# Altium project fyFly.PrjPcb
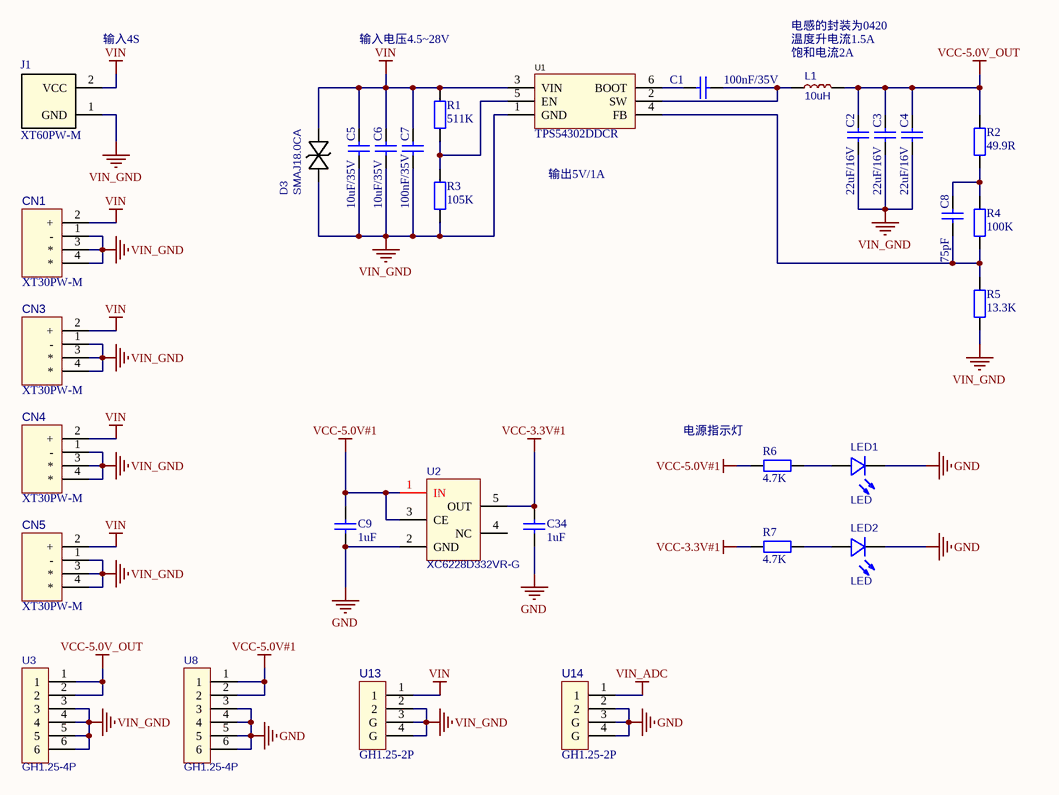
[diagram p0: 00_power.SchDoc]
4 sheets, 121 parts. Net scope: global (net labels, ports and power ports of the same name join across sheets).
Board files: fyFly.PcbDoc, fyFly _cp1.PcbDoc, fyFly_cp2.PcbDoc
Sheets:
  00_power.SchDoc
  01_mcu.SchDoc
  02_sensor.SchDoc
  03_peripheral.SchDoc

## Sheet 00_power.SchDoc
size A4; SheetNumber: 1; SheetTotal: 4

### Parts
C1  100nF/35V  [0603-C]
C2  22uF/16V  [1206-C]
C3  22uF/16V  [1206-C]
C4  22uF/16V  [1206-C]
C5  10uF/35V  [0805-C]
C6  10uF/35V  [0805-C]
C7  100nF/35V  [0805-C]
C8  75pF  [0603-C]
C9  1uF  [0603-C]
C34  1uF  [0603-C]
CN1  XT30PW-M  [XT30PW-M]
CN3  XT30PW-M  [XT30PW-M]
CN4  XT30PW-M  [XT30PW-M]
CN5  XT30PW-M  [XT30PW-M]
D3  SMAJ18.0CA  [ZENER]
J1  XT60PW-M  [XT60PW-M]
L1  10uH  [电感 4.2X4.4]
LED1  LED  [LED-0603]
LED2  LED  [LED-0603]
R1  511K  [0603-R]
R2  49.9R  [0603-R]
R3  105K  [0603-R]
R4  100K  [0603-R]
R5  13.3K  [0603-R]
R6  4.7K  [0603-R]
R7  4.7K  [0603-R]
U1  TPS54302DDCR  [TPS54302]
U2  XC6228D332VR-G  [XC6228D332VR-G]
U3  GH1.25-4P  [CONN-SMD_GH1.25-4PWBPZ]
U8  GH1.25-4P  [CONN-SMD_GH1.25-4PWBPZ]
U13  GH1.25-2P  [GH1.25-2P]
U14  GH1.25-2P  [GH1.25-2P]

### Nets
GND: C9.1 C34.1 LED1.1(-) LED2.1(-) U2.2(GND) U8.3 U8.4 U8.5 U8.6 U14.2 U14.3(G) U14.4(G)
VCC-3.3V#1: C34.2 R7.1 U2.5(OUT)
VCC-5.0V#1: C9.2 R6.1 U2.1(IN) U2.3(CE) U8.1 U8.2
VCC-5.0V_OUT: C2.2 C3.2 C4.2 L1.2 R2.2 U3.1 U3.2
VIN: C5.2 C6.2 C7.2 CN1.2(+) CN3.2(+) CN4.2(+) CN5.2(+) D3.2(A) J1.2(VCC) R1.2 U1.3(VIN) U13.1
VIN_ADC: U14.1
VIN_GND: C2.1 C3.1 C4.1 C5.1 C6.1 C7.1 CN1.1(-) CN1.3 CN1.4 CN3.1(-) CN3.3 CN3.4 CN4.1(-) CN4.3 CN4.4 CN5.1(-) CN5.3 CN5.4 D3.1(C) J1.1(GND) R3.1 R5.1 U1.1(GND) U3.3 U3.4 U3.5 U3.6 U13.2 U13.3(G) U13.4(G)
NetC1_1: C1.1 U1.6(BOOT)
NetC1_2: C1.2 L1.1 U1.2(SW)
NetC8_1: C8.1 R4.1 R5.2 U1.4(FB)
NetC8_2: C8.2 R2.1 R4.2
NetLED1_2: LED1.2(+) R6.2
NetLED2_2: LED2.2(+) R7.2
NetR1_1: R1.1 R3.2 U1.5(EN)

Not connected (* = marked no-connect by the designer): U2 4(NC)

### Notes on the sheet
- (near J1) 输入4S
- 输入电压4.5~28V
- 电感的封装为0420
- (near L1) 温度升电流1.5A
- (near L1) 饱和电流2A
- 输出5V/1A
- 电源指示灯

### Library data of the parts
C1-C9 C34 = C: 贴片电容; BOM名称: 无极性贴片电容; 联系卖家，免费查找封装: 唯一出售店铺网址https://shop463601444.taobao.com
CN1 CN3-CN5 = XT30PW-M: Manufacturer: AMASS(艾迈斯); Add into BOM: yes; Brand: 艾迈斯; RatedVoltage: DC 500V; InterfaceType: 公头; RatedCurrent: 15A; RecommendedWireGauge: 16/18/20AWG; contact resistance: 1.2mΩ; specifications: 2pin; Symbol: XT30PW-M; Device: XT30PW-M; Supplier: LCSC; Supplier Part: C431092; Manufacturer Part: XT30PW-M; JLCPCB Part Class: Extended Part; LCSC Part Name: AMASS(艾迈斯)航模插头 卧式弯脚 XT30PW-M公头; Supplier Footprint: -; Datasheet: https://atta.szlcsc.com/upload/public/pdf/source/20220222/6A9F22F7850E25B33E1BE430ADF8560B.pdf; Convert to PCB: yes; Model: XT30PW-M; Power: -; Output: -; Input: -; Size: -; Interface: -; Type: 航模插头; Colour: -; MaximumCurrent: -; Type1: -; NumberOfUSBHoles: -; MetalMaterial: -; InsulationMaterial: -; FlameRetardantGrade: -; Belt length: -
D3 = SMAJ6.0CA: SMAJ6.0CA_C698928; BOM_Manufacturer: Yangzhou Yangjie Elec Tech; Contributor: LCSC; BOM_Supplier: LCSC; BOM_Supplier Part: C698928; BOM_Manufacturer Part: SMAJ6.0CA; BOM_JLCPCB Part Class: Extended Part; spicePre: D; spiceSymbolName: SMAJ6.0CA_C698928
J1 = XT60PW-M: PCB Power Connector; Manufacturer_Name: Amass; Manufacturer_Part_Number: XT60PW-F; Datasheet Link: https://www.tme.eu/sl/Document/ce4077e36b79046da520ca73227e15de/XT30PW%20SPEC.pdf; Height: 8.4mm
L1 = L: BOM_Manufacturer: Sunlord; BOM_Manufacturer Part: UPZ2012D800-4R0TF; nameAlias: Value; Contributor: LCSC; BOM_Supplier: LCSC; BOM_Supplier Part: C145060; BOM_JLCPCB Part Class: Extended Part; spicePre: L; spiceSymbolName: UPZ2012D800-4R0TF
LED1 LED2 = LED: BOM_Manufacturer: Wuxi ARK Tech Elec; BOM_Manufacturer Part: D-G060306G1-KS2; Contributor: LCSC; BOM_Supplier: LCSC; BOM_Supplier Part: C118334; BOM_JLCPCB Part Class: Extended Part; spicePre: L; spiceSymbolName: D-G060306G1-KS2
R1-R7 = R: 贴片电阻; 联系卖家，免费查找封装: 唯一出售店铺网址https://shop463601444.taobao.com; BOM名称: 贴片电阻
U1 = TPS54302DDCR: Manufacturer: TI(德州仪器); Symbol: TPS54302DDCR_C311983; Add into BOM: yes; Function: 降压型; Synchronous Rectification: 是; Output Type: 可调; Number of Outputs: 1; Topology: 降压式; Input Voltage: 4.5V~28V; Output Voltage: 596mV~28V; Output Current (Max): 3A; Switching Frequency: 400kHz; Device: TPS54302DDCR; LCSC Part Name: 降压型 输入4.5V~28V 输出596mV~28V 3A; Supplier Part: C311983; Manufacturer Part: TPS54302DDCR; Supplier Footprint: TSOT-23-6; JLCPCB Part Class: Extended Part; Datasheet: https://atta.szlcsc.com/upload/public/pdf/source/20181023/C311983_0948EE70BFAD2011B492BD3F4CEA709D.pdf; Supplier: LCSC; Convert to PCB: yes; Operating Temperature: -40℃~+125℃@(TJ)
U2 = XC6228D332VR-G: 输出类型：固定 输出极性：正 输出通道数：1 最大输入电压：5.5V 输出电压：3.3V 压差：305mV@(300mA) 输出电流：300mA 电源纹波抑制比(PSRR)：80dB@(1kHz) 3.3V固定输出，Iout=300mA，Vin=5.5V(Max); BOM_Manufacturer: TOREX; BOM_Supplier: LCSC; BOM_Manufacturer Part: XC6228D332VR-G; BOM_Supplier Part: C69841; BOM_JLCPCB Part Class: Extended Part; spicePre: U; spiceSymbolName: XC6228D332VR-G
U3 U8 = GH1.25-4P: GH1.25-4PWBPZ; BOM_Manufacturer: BOOMELE(博穆精密); Contributor: LCSC; BOM_Supplier: LCSC; BOM_Supplier Part: C2829253; BOM_Manufacturer Part: GH1.25-4PWBPZ; spicePre: U; spiceSymbolName: GH1.25-4PWBPZ
U13 U14 = GH1.25-2P: Manufacturer: Bossie(博锡); Symbol: BX-GH1.25-2PWT; Add into BOM: yes; Pins Structure: 1x2P; Pitch: 1.25mm; Reference Series: GH; Number of PINs Per Row: 2; Current Rating (Max): 1A; Device: BX-GH1.25-2PWT; Supplier: LCSC; Supplier Part: C18077718; Manufacturer Part: BX-GH1.25-2PWT; LCSC Part Name: BX-GH1.25-2PWT; Supplier Footprint: SMD,P=1.25mm,卧贴; Datasheet: https://atta.szlcsc.com/upload/public/pdf/source/20231017/25DD0A5C9398B9B8D9D2789B9E1BDAD3.pdf; Convert to PCB: yes; Mounting Style: 卧贴; Number of Pins: 2P; Number of Rows: 1; Row Spacing: -; Contact Material: 磷铜; Contact Plating: 锡; Operating Temperature Range: -25℃~+85℃

## Sheet 01_mcu.SchDoc
size A4; SheetNumber: 2; SheetTotal: 4
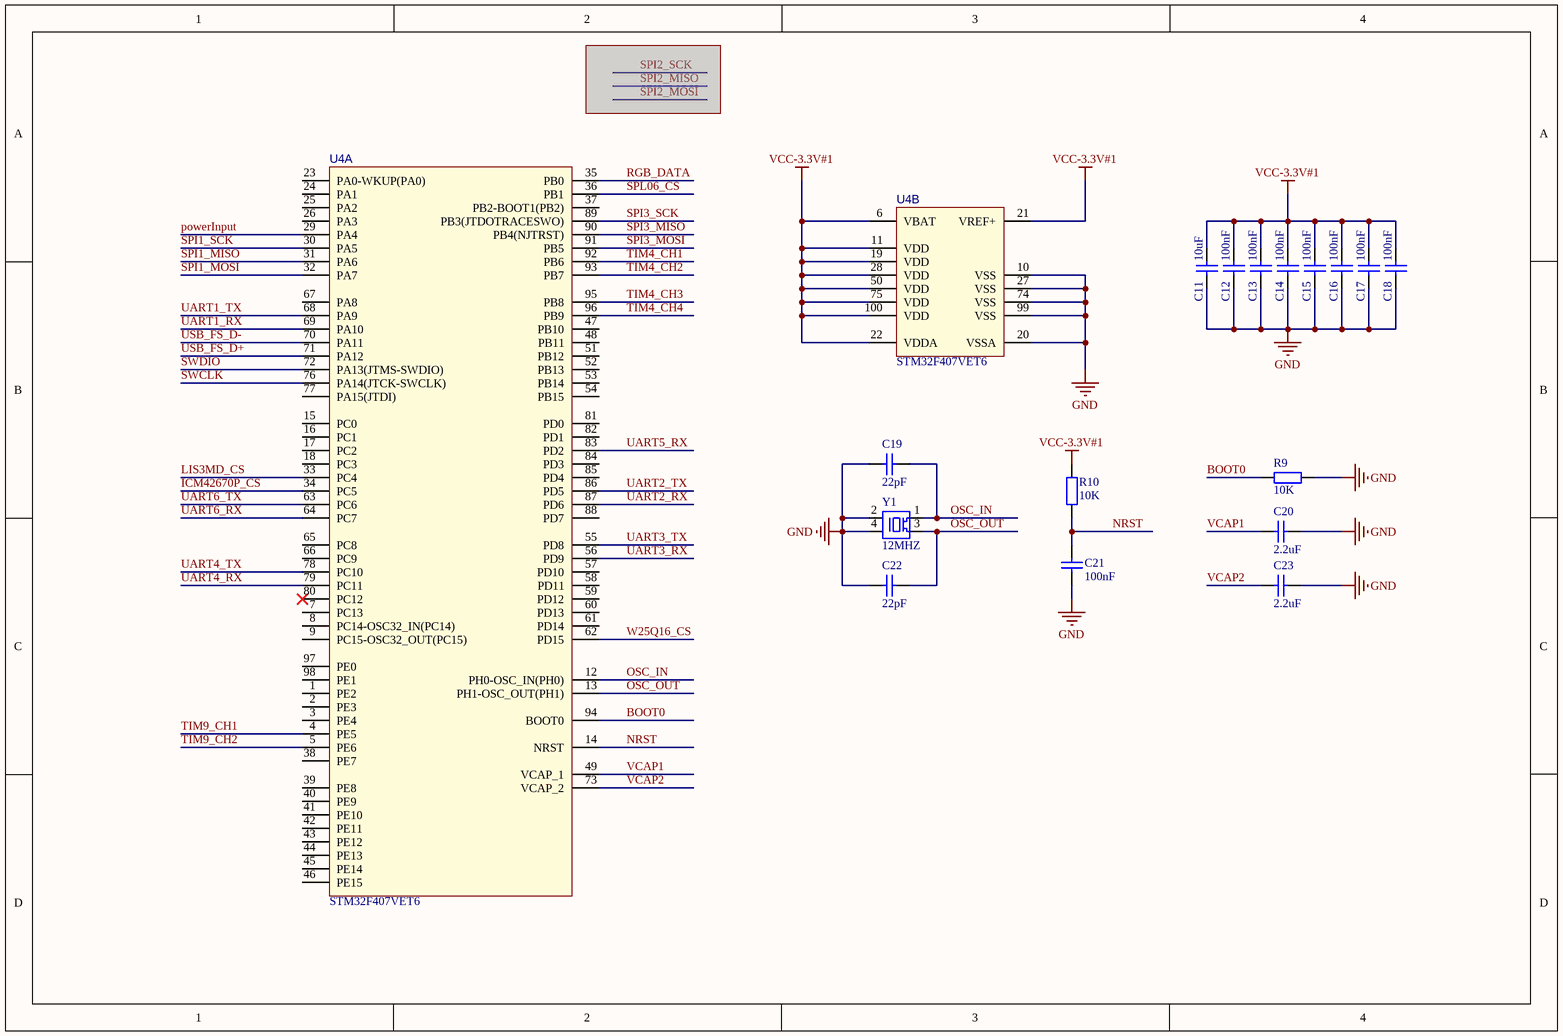
[diagram p1: 01_mcu.SchDoc]

### Parts
C11  10uF  [0603-C]
C12  100nF  [0603-C]
C13  100nF  [0603-C]
C14  100nF  [0603-C]
C15  100nF  [0603-C]
C16  100nF  [0603-C]
C17  100nF  [0603-C]
C18  100nF  [0603-C]
C19  22pF  [0603-C]
C20  2.2uF  [0603-C]
C21  100nF  [0603-C]
C22  22pF  [0603-C]
C23  2.2uF  [0603-C]
R9  10K  [0603-R]
R10  10K  [0603-R]
U4  STM32F407VET6  [STM32F407VET6]  (parts A,B of 2)
Y1  12MHZ  [3225]

### Nets
GND: C11.1 C12.1 C13.1 C14.1 C15.1 C16.1 C17.1 C18.1 C19.1 C20.2 C21.1 C22.1 C23.2 R9.1 U4.10(VSS) U4.20(VSSA) U4.27(VSS) U4.74(VSS) U4.99(VSS) Y1.2(GND) Y1.4(GND)
VCC-3.3V#1: C11.2 C12.2 C13.2 C14.2 C15.2 C16.2 C17.2 C18.2 R10.2 U4.6(VBAT) U4.11(VDD) U4.19(VDD) U4.21(VREF+) U4.22(VDDA) U4.28(VDD) U4.50(VDD) U4.75(VDD) U4.100(VDD)
BOOT0: R9.2 U4.94(BOOT0)
ICM42670P_CS: U4.34(PC5)
LIS3MD_CS: U4.33(PC4)
NRST: C21.2 R10.1 U4.14(NRST)
OSC_IN: C19.2 U4.12(PH0-OSC_IN(PH0)) Y1.1(XTAL1)
OSC_OUT: C22.2 U4.13(PH1-OSC_OUT(PH1)) Y1.3(XTAL3)
powerInput: U4.29(PA4)
RGB_DATA: U4.35(PB0)
SPI1_MISO: U4.31(PA6)
SPI1_MOSI: U4.32(PA7)
SPI1_SCK: U4.30(PA5)
SPI3_MISO: U4.90(PB4(NJTRST))
SPI3_MOSI: U4.91(PB5)
SPI3_SCK: U4.89(PB3(JTDOTRACESWO))
SPL06_CS: U4.36(PB1)
SWCLK: U4.76(PA14(JTCK-SWCLK))
SWDIO: U4.72(PA13(JTMS-SWDIO))
TIM4_CH1: U4.92(PB6)
TIM4_CH2: U4.93(PB7)
TIM4_CH3: U4.95(PB8)
TIM4_CH4: U4.96(PB9)
TIM9_CH1: U4.4(PE5)
TIM9_CH2: U4.5(PE6)
UART1_RX: U4.69(PA10)
UART1_TX: U4.68(PA9)
UART2_RX: U4.87(PD6)
UART2_TX: U4.86(PD5)
UART3_RX: U4.56(PD9)
UART3_TX: U4.55(PD8)
UART4_RX: U4.79(PC11)
UART4_TX: U4.78(PC10)
UART5_RX: U4.83(PD2)
UART6_RX: U4.64(PC7)
UART6_TX: U4.63(PC6)
USB_FS_D+: U4.71(PA12)
USB_FS_D-: U4.70(PA11)
VCAP1: C20.1 U4.49(VCAP_1)
VCAP2: C23.1 U4.73(VCAP_2)
W25Q16_CS: U4.62(PD15)

Not connected (* = marked no-connect by the designer): U4 1(PE2) 2(PE3) 3(PE4) 7(PC13) 8(PC14-OSC32_IN(PC14)) 9(PC15-OSC32_OUT(PC15)) 15(PC0) 16(PC1) 17(PC2) 18(PC3) 23(PA0-WKUP(PA0)) 24(PA1) 25(PA2) 26(PA3) 37(PB2-BOOT1(PB2)) 38(PE7) 39(PE8) 40(PE9) 41(PE10) 42(PE11) 43(PE12) 44(PE13) 45(PE14) 46(PE15) 47(PB10) 48(PB11) 51(PB12) 52(PB13) 53(PB14) 54(PB15) 57(PD10) 58(PD11) 59(PD12) 60(PD13) 61(PD14) 65(PC8) 66(PC9) 67(PA8) 77(PA15(JTDI)) 80(PC12)* 81(PD0) 82(PD1) 84(PD3) 85(PD4) 88(PD7) 97(PE0) 98(PE1)

### Library data of the parts
C11-C23 = C: as C1 on sheet 00_power
R9 R10 = R: as R1 on sheet 00_power; BOM名称: 贴片电阻
U4 = STM32F407VET6: Manufacturer: ST(意法半导体); Add into BOM: yes; CPU Core: ARM Cortex-M4; CPU Maximum Speed: 168MHz; Operating Voltage Range: 1.8V~3.6V; Program Storage Size: 512KB; Program Memory Type: FLASH; RAM Size: 192KB; GPIO Ports Number: 82; ADC (Bit): 12bit; Universal Serial Bus: 有; Peripheral/Function: DMA；LCD/LED驱动；PWM; tags: STM32; Name: STM32F407VET6; Symbol: STM32F407VET6; Device: STM32F407VET6; LCSC Part Name: STM32F407VET6; Supplier Part: C28730; Manufacturer Part: STM32F407VET6; Supplier Footprint: LQFP-100(14x14); JLCPCB Part Class: Extended Part; Datasheet: https://atta.szlcsc.com/upload/public/pdf/source/20140801/1457707197138.pdf; Supplier: LCSC; Convert to PCB: yes; EEPROM: -; DAC (Bit): 12bit; PWM (Bit): -; Internal Comparator: -; communication protocol: -; Watchdog: 有; Real-Time Clock: -; Infrared Data Association: 有; Low-Voltage Detect: 有; CCP Capture/Compare: -; LCD Module: 有; Secure Digital Input and Output: -; Direct Memory Access: 有; Internal Oscillator: 有; Operating Temperature Range: -40℃~+85℃; image: http://image.lceda.cn/szlcsc/C28730.jpg
Y1 = Y: 无源晶振

## Sheet 02_sensor.SchDoc
size A3; SheetNumber: 3; SheetTotal: 4
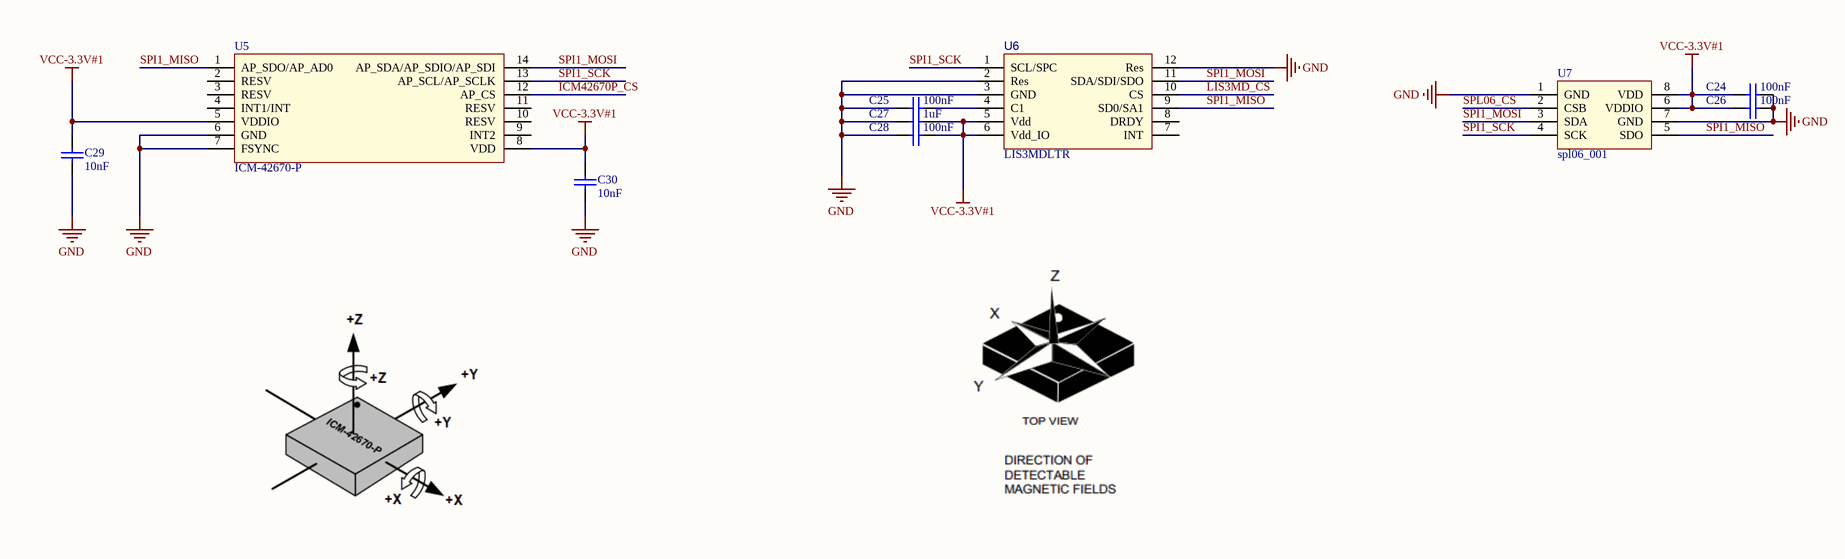
[diagram p2: 02_sensor.SchDoc]

### Parts
C24  100nF  [0603-C]
C25  100nF  [0603-C]
C26  100nF  [0603-C]
C27  1uF  [0603-C]
C28  100nF  [0603-C]
C29  10nF  [0603-C]
C30  10nF  [0603-C]
U5  ICM-42670-P  [ICM42670P]
U6  LIS3MDLTR  [LIS3MDLTR]
U7  spl06_001  [SPL06]

### Nets
GND: C24.2 C25.1 C26.2 C27.1 C28.1 C29.1 C30.1 U5.6(GND) U5.7(FSYNC) U6.2(Res) U6.3(GND) U6.12(Res) U7.1(GND) U7.7(GND)
VCC-3.3V#1: C24.1 C26.1 C27.2 C28.2 C29.2 C30.2 U5.5(VDDIO) U5.8(VDD) U6.5(Vdd) U6.6(Vdd_IO) U7.6(VDDIO) U7.8(VDD)
ICM42670P_CS: U5.12(AP_CS)
LIS3MD_CS: U6.10(CS)
SPI1_MISO: U5.1(AP_SDO/AP_AD0) U6.9(SD0/SA1) U7.5(SDO)
SPI1_MOSI: U5.14(AP_SDA/AP_SDIO/AP_SDI) U6.11(SDA/SDI/SDO) U7.3(SDA)
SPI1_SCK: U5.13(AP_SCL/AP_SCLK) U6.1(SCL/SPC) U7.4(SCK)
SPL06_CS: U7.2(CSB)
NetC25_2: C25.2 U6.4(C1)

Not connected (* = marked no-connect by the designer): U5 2(RESV) 3(RESV) 4(INT1/INT) 9(INT2) 10(RESV) 11(RESV); U6 7(INT) 8(DRDY)

### Library data of the parts
C24-C30 = C: as C1 on sheet 00_power
U5 = ICM-42670-P: Manufacturer: TDK InvenSense(应美盛); Add into BOM: yes; Sensor Type: 加速度计陀螺仪; Symbol: ICM-42670-P; Device: ICM-42670-P; Supplier: LCSC; Supplier Part: C3288646; Manufacturer Part: ICM-42670-P; JLCPCB Part Class: 扩展库; LCSC Part Name: ICM-42670-P; Supplier Footprint: LGA-14(2.5x3); Datasheet: /pdf/applyPasteComponent/2023-06-06/453894A/f777f4f41a0e4ea2b93b88a9675b1ac5/ICM-42670-P.pdf; Convert to PCB: yes; Operating Temperature: -40℃~+85℃; Name: ICM-42670-P
U6 = LIS3MDLTR: Manufacturer: ST(意法半导体); Add into BOM: yes; supply voltage: 1.9V~3.6V; Symbol: LIS3MDLTR; Device: LIS3MDLTR; Supplier: LCSC; Supplier Part: C478483; Manufacturer Part: LIS3MDLTR; JLCPCB Part Class: Extended Part; LCSC Part Name: 三轴数字磁传感器; Supplier Footprint: LGA-12(2x2); Datasheet: https://atta.szlcsc.com/upload/public/pdf/source/20191231/C478483_325C07DDDEF2D93C2E541FB70AD6AC5C.pdf; Convert to PCB: yes; Operating Temperature: -40℃~+85℃
U7 = SPL06_001: 气压计

## Sheet 03_peripheral.SchDoc
size A3; SheetNumber: 4; SheetTotal: 4
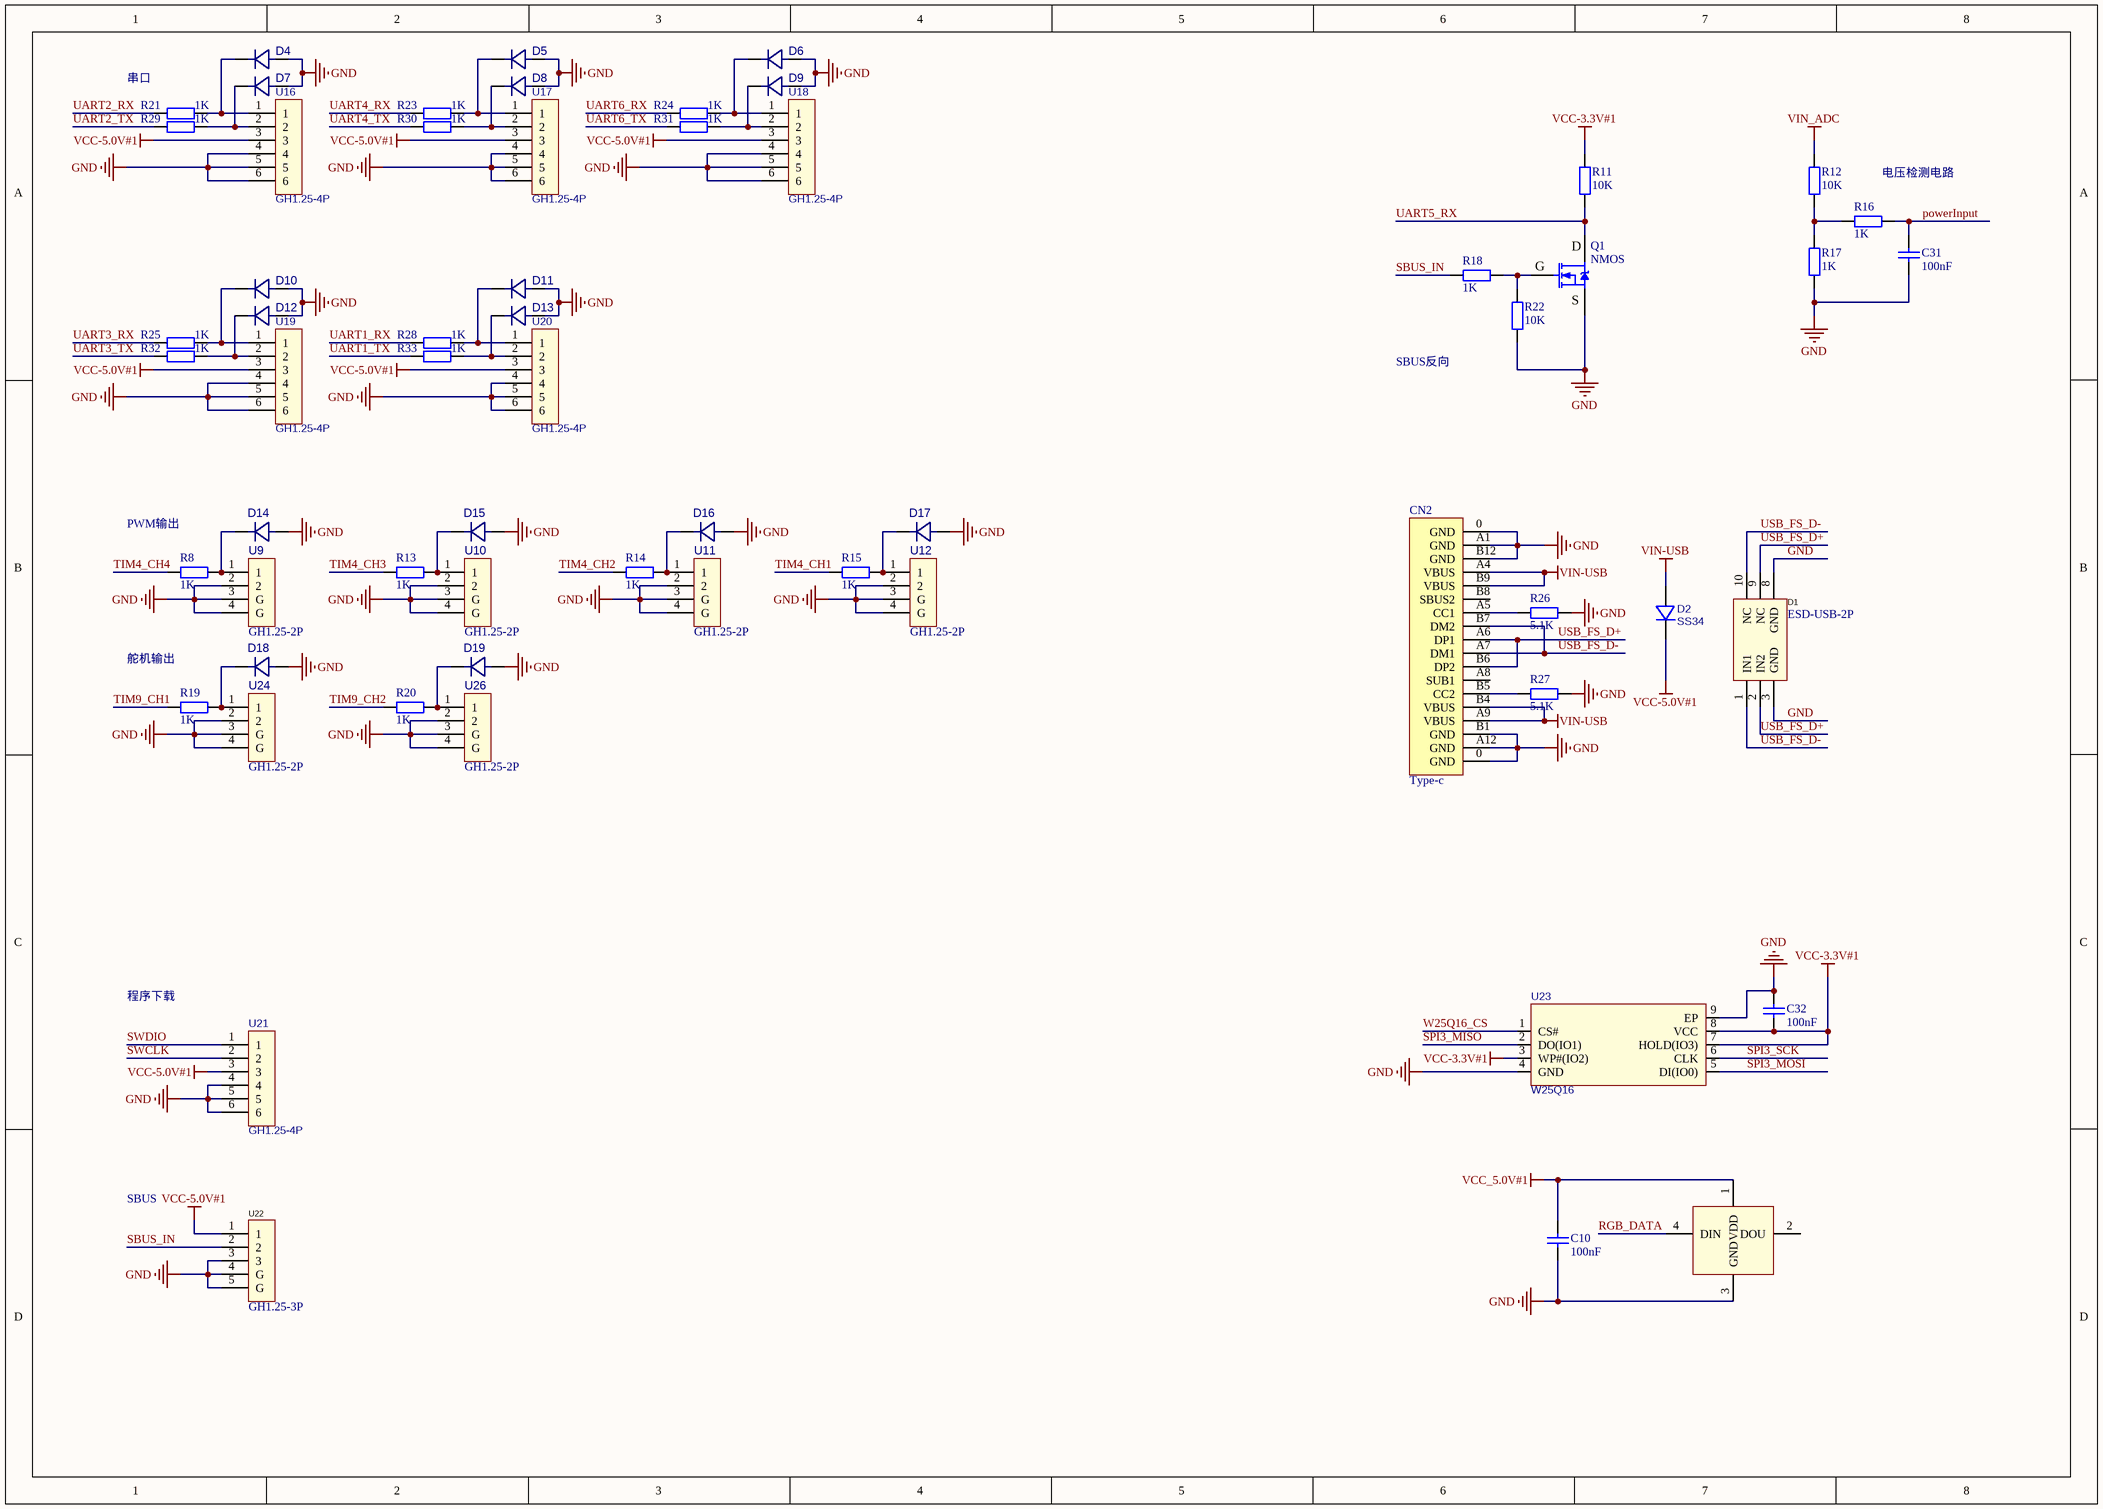
[diagram p3: 03_peripheral.SchDoc]

### Parts
C10  100nF  [0603-C]
C31  100nF  [0603-C]
C32  100nF  [0603-C]
CN2  Type-c  [Type-c 16pin]
D1  ESD-USB-2P  [SLP2510P8-2P]
D2  SS34  [SS34-SMA]
D4  ESD9X5.0ST5G  [ESD9X5.0ST5G]  (value not drawn)
D5  ESD9X5.0ST5G  [ESD9X5.0ST5G]  (value not drawn)
D6  ESD9X5.0ST5G  [ESD9X5.0ST5G]  (value not drawn)
D7  ESD9X5.0ST5G  [ESD9X5.0ST5G]  (value not drawn)
D8  ESD9X5.0ST5G  [ESD9X5.0ST5G]  (value not drawn)
D9  ESD9X5.0ST5G  [ESD9X5.0ST5G]  (value not drawn)
D10  ESD9X5.0ST5G  [ESD9X5.0ST5G]  (value not drawn)
D11  ESD9X5.0ST5G  [ESD9X5.0ST5G]  (value not drawn)
D12  ESD9X5.0ST5G  [ESD9X5.0ST5G]  (value not drawn)
D13  ESD9X5.0ST5G  [ESD9X5.0ST5G]  (value not drawn)
D14  ESD9X5.0ST5G  [ESD9X5.0ST5G]  (value not drawn)
D15  ESD9X5.0ST5G  [ESD9X5.0ST5G]  (value not drawn)
D16  ESD9X5.0ST5G  [ESD9X5.0ST5G]  (value not drawn)
D17  ESD9X5.0ST5G  [ESD9X5.0ST5G]  (value not drawn)
D18  ESD9X5.0ST5G  [ESD9X5.0ST5G]  (value not drawn)
D19  ESD9X5.0ST5G  [ESD9X5.0ST5G]  (value not drawn)
LED3  WS2812B-5050  [WS2812B-5050]  (value not drawn)
Q1  NMOS  [SOT23-3M]
R8  1K  [0603-R]
R11  10K  [0603-R]
R12  10K  [0603-R]
R13  1K  [0603-R]
R14  1K  [0603-R]
R15  1K  [0603-R]
R16  1K  [0603-R]
R17  1K  [0603-R]
R18  1K  [0603-R]
R19  1K  [0603-R]
R20  1K  [0603-R]
R21  1K  [0603-R]
R22  10K  [0603-R]
R23  1K  [0603-R]
R24  1K  [0603-R]
R25  1K  [0603-R]
R26  5.1K  [0603-R]
R27  5.1K  [0603-R]
R28  1K  [0603-R]
R29  1K  [0603-R]
R30  1K  [0603-R]
R31  1K  [0603-R]
R32  1K  [0603-R]
R33  1K  [0603-R]
U9  GH1.25-2P  [GH1.25-2P]
U10  GH1.25-2P  [GH1.25-2P]
U11  GH1.25-2P  [GH1.25-2P]
U12  GH1.25-2P  [GH1.25-2P]
U16  GH1.25-4P  [CONN-SMD_GH1.25-4PWBPZ]
U17  GH1.25-4P  [CONN-SMD_GH1.25-4PWBPZ]
U18  GH1.25-4P  [CONN-SMD_GH1.25-4PWBPZ]
U19  GH1.25-4P  [CONN-SMD_GH1.25-4PWBPZ]
U20  GH1.25-4P  [CONN-SMD_GH1.25-4PWBPZ]
U21  GH1.25-4P  [CONN-SMD_GH1.25-4PWBPZ]
U22  GH1.25-3P  [GH1.25-3P]
U23  W25Q16  [W25QXX_WSON_8_5*6mm]
U24  GH1.25-2P  [GH1.25-2P]
U26  GH1.25-2P  [GH1.25-2P]

### Nets
GND: C10.1 C31.1 C32.2 CN2.0(GND) CN2.A1(GND) CN2.A12(GND) CN2.B1(GND) CN2.B12(GND) D1.3(GND) D1.8(GND) D4.2(A) D5.2(A) D6.2(A) D7.2(A) D8.2(A) D9.2(A) D10.2(A) D11.2(A) D12.2(A) D13.2(A) D14.2(A) D15.2(A) D16.2(A) D17.2(A) D18.2(A) D19.2(A) LED3.3(GND) Q1.2(S) R17.1 R22.1 R26.2 R27.2 U9.2 U9.3(G) U9.4(G) U10.2 U10.3(G) U10.4(G) U11.2 U11.3(G) U11.4(G) U12.2 U12.3(G) U12.4(G) U16.4 U16.5 U16.6 U17.4 U17.5 U17.6 U18.4 U18.5 U18.6 U19.4 U19.5 U19.6 U20.4 U20.5 U20.6 U21.4 U21.5 U21.6 U22.3 U22.4(G) U22.5(G) U23.4(GND) U23.9(EP) U24.2 U24.3(G) U24.4(G) U26.2 U26.3(G) U26.4(G)
VCC-3.3V#1: C32.1 R11.2 U23.3(WP#(IO2)) U23.7(HOLD(IO3)) U23.8(VCC)
VCC-5.0V#1: D2.2(-) U16.3 U17.3 U18.3 U19.3 U20.3 U21.3 U22.1
VCC_5.0V#1: C10.2 LED3.1(VDD)
VIN-USB: CN2.A4(VBUS) CN2.A9(VBUS) CN2.B4(VBUS) CN2.B9(VBUS) D2.1(+)
VIN_ADC: R12.2
powerInput: C31.2 R16.2
RGB_DATA: LED3.4(DIN)
SBUS_IN: R18.1 U22.2
SPI3_MISO: U23.2(DO(IO1))
SPI3_MOSI: U23.5(DI(IO0))
SPI3_SCK: U23.6(CLK)
SWCLK: U21.2
SWDIO: U21.1
TIM4_CH1: R15.1
TIM4_CH2: R14.1
TIM4_CH3: R13.1
TIM4_CH4: R8.1
TIM9_CH1: R19.1
TIM9_CH2: R20.1
UART1_RX: R28.1
UART1_TX: R33.1
UART2_RX: R21.1
UART2_TX: R29.1
UART3_RX: R25.1
UART3_TX: R32.1
UART4_RX: R23.1
UART4_TX: R30.1
UART5_RX: Q1.3(D) R11.1
UART6_RX: R24.1
UART6_TX: R31.1
USB_FS_D+: CN2.A6(DP1) CN2.B6(DP2) D1.2(IN2) D1.9(NC)
USB_FS_D-: CN2.A7(DM1) CN2.B7(DM2) D1.1(IN1) D1.10(NC)
W25Q16_CS: U23.1(CS#)
NetCN2_A5: CN2.A5(CC1) R26.1
NetCN2_B5: CN2.B5(CC2) R27.1
NetD4_1: D4.1(K) R21.2 U16.1
NetD5_1: D5.1(K) R23.2 U17.1
NetD6_1: D6.1(K) R24.2 U18.1
NetD7_1: D7.1(K) R29.2 U16.2
NetD8_1: D8.1(K) R30.2 U17.2
NetD9_1: D9.1(K) R31.2 U18.2
NetD10_1: D10.1(K) R25.2 U19.1
NetD11_1: D11.1(K) R28.2 U20.1
NetD12_1: D12.1(K) R32.2 U19.2
NetD13_1: D13.1(K) R33.2 U20.2
NetD14_1: D14.1(K) R8.2 U9.1
NetD15_1: D15.1(K) R13.2 U10.1
NetD16_1: D16.1(K) R14.2 U11.1
NetD17_1: D17.1(K) R15.2 U12.1
NetD18_1: D18.1(K) R19.2 U24.1
NetD19_1: D19.1(K) R20.2 U26.1
NetQ1_1: Q1.1(G) R18.2 R22.2
NetR12_1: R12.1 R16.1 R17.2

Not connected (* = marked no-connect by the designer): CN2 A8(SUB1) B8(SBUS2); LED3 2(DOU)

### Notes on the sheet
- 串口
- (near R16) 电压检测电路
- SBUS反向
- (near R8) PWM输出
- (near R19) 舵机输出
- 程序下载
- SBUS

### Library data of the parts
C10 C31 C32 = C: as C1 on sheet 00_power
CN2 = Type-c: U262-161N-4BVC11
D1 = ESD-USB-2P: RClamp0522PATCT; Manufacturer: SEMTECH; Name: RClamp0524PATCT; Device: RClamp0524PATCT_C40960; Add into BOM: yes; Reverse Stand-Off Voltage (Vrwm): 5V; Breakdown Voltage (VBR): 6V; Clamping Voltage@Ipp: 15V; Peak Pulse Power(Ppp)@8/20us: 150W; Junction Capacitance(Cj)@1MHz: 0.8pF@1MHz; Symbol: RClamp0524PATCT; LCSC Part Name: RClamp0524PATCT; Supplier Part: C40960; Manufacturer Part: RClamp0524PATCT; Supplier Footprint: SLP2510P8; JLCPCB Part Class: Extended Part; Datasheet: https://atta.szlcsc.com/upload/public/pdf/source/20150124/1457707260739.pdf; Supplier: LCSC; Convert to PCB: yes; Operating Temperature: -55℃~+125℃@(Tj)
D2 = SS34: BOM_Manufacturer: Wuxi ARK Tech Elec; BOM_Manufacturer Part: D-G060306G1-KS2; Contributor: LCSC; BOM_Supplier: LCSC; BOM_Supplier Part: C118334; BOM_JLCPCB Part Class: Extended Part; spicePre: L; spiceSymbolName: D-G060306G1-KS2
D4-D19 = ESD9X5.0ST5G: Manufacturer: MSKSEMI(美森科); Symbol: ESD9X5.0ST5G_C3008066; Add into BOM: yes; Name: ESD9X5.0ST5G; Device: ESD9X5.0ST5G_C3008066; LCSC Part Name: ESD9X5.0ST5G; Supplier Part: C3008066; Manufacturer Part: ESD9X5.0ST5G; Supplier Footprint: SOD-923; JLCPCB Part Class: Extended Part; Datasheet: https://atta.szlcsc.com/upload/public/pdf/source/20220429/68E9B40153609821FAF30C4C48AA4713.pdf; Supplier: LCSC; Convert to PCB: yes
LED3 = WS2812B-5050: Manufacturer: XINGLIGHT(成兴光); Name: XL-5050RGBC-WS2812B; Add into BOM: yes; Emitted Color: RGB三色; Lens Color: 无色透明; Peak Wavelength: 625nm；470nm；530nm; Viewing Angle: 120°; Mounting Sytle: 正贴; Symbol: XL-5050RGBC-WS2812B; Device: XL-5050RGBC-WS2812B; LCSC Part Name: RGB三色 正贴 幻彩; Supplier Part: C2843785; Manufacturer Part: XL-5050RGBC-WS2812B; Supplier Footprint: SMD5050; JLCPCB Part Class: Extended Part; Datasheet: https://atta.szlcsc.com/upload/public/pdf/source/20230111/86AAD2096485A2E5BCAB883FF8CBE6FD.pdf; Supplier: LCSC; Convert to PCB: yes; Diode Configuration: -; Dominant Wavelength: -; Color Temperature: -; Forward Current: -; Power Dissipation: -; Operating Temperature: -30℃~+70℃
Q1 = AO3400: N沟道 30V/4.2A; BOM名称: 场效应管; 联系卖家，免费查找封装: 唯一出售店铺网址https://shop463601444.taobao.com; 参数: N沟道 30V/4.2A
R8 R11-R33 = R: as R1 on sheet 00_power; BOM名称: 贴片电阻
U9-U12 U24 U26 = GH1.25-2P: as U13 on sheet 00_power; Device: BX-GH1.25-2PWT; Supplier: LCSC; Supplier Part: C18077718; Manufacturer Part: BX-GH1.25-2PWT; LCSC Part Name: BX-GH1.25-2PWT; Supplier Footprint: SMD,P=1.25mm,卧贴; Datasheet: https://atta.szlcsc.com/upload/public/pdf/source/20231017/25DD0A5C9398B9B8D9D2789B9E1BDAD3.pdf; Convert to PCB: yes; Mounting Style: 卧贴; Number of Pins: 2P; Number of Rows: 1; Row Spacing: -; Contact Material: 磷铜; Contact Plating: 锡; Operating Temperature Range: -25℃~+85℃
U16-U21 = GH1.25-4P: as U3 on sheet 00_power; BOM_Supplier: LCSC; BOM_Supplier Part: C2829253; BOM_Manufacturer Part: GH1.25-4PWBPZ; spicePre: U; spiceSymbolName: GH1.25-4PWBPZ
U22 = GH1.25-3P: Manufacturer: Bossie(博锡); Symbol: BX-GH1.25-3PWT; Add into BOM: yes; Pins Structure: 1x3P; Pitch: 1.25mm; Reference Series: GH; Number of PINs Per Row: 3; Current Rating (Max): 1A; Device: BX-GH1.25-3PWT; Supplier: LCSC; Supplier Part: C18077719; Manufacturer Part: BX-GH1.25-3PWT; LCSC Part Name: BX-GH1.25-3PWT; Supplier Footprint: SMD,P=1.25mm,卧贴; Datasheet: https://atta.szlcsc.com/upload/public/pdf/source/20231017/A589687BD41735CD2F726065058FB819.pdf; Convert to PCB: yes; Mounting Style: 卧贴; Number of Pins: 3P; Number of Rows: 1; Row Spacing: -; Contact Material: 磷铜; Contact Plating: 锡; Operating Temperature Range: -25℃~+85℃
U23 = W25Q256: BOM_Manufacturer: WINBOND(华邦); BOM_Manufacturer Part: W25Q256JVEIQ; Contributor: LCSC; BOM_Supplier: LCSC; BOM_Supplier Part: C2682312; BOM_JLCPCB Part Class: Extended Part; spicePre: U; spiceSymbolName: W25Q256JVEIQ

## Nets that join several sheets
GND: 00_power (12 pins), 01_mcu (21 pins), 02_sensor (14 pins), 03_peripheral (73 pins)
VCC-3.3V#1: 00_power (C34.2 R7.1 U2.5), 01_mcu (18 pins), 02_sensor (12 pins), 03_peripheral (5 pins)
VCC-5.0V#1: 00_power (6 pins), 03_peripheral (8 pins)
VIN_ADC: 00_power (U14.1), 03_peripheral (R12.2)
ICM42670P_CS: 01_mcu (U4.34), 02_sensor (U5.12)
LIS3MD_CS: 01_mcu (U4.33), 02_sensor (U6.10)
powerInput: 01_mcu (U4.29), 03_peripheral (C31.2 R16.2)
RGB_DATA: 01_mcu (U4.35), 03_peripheral (LED3.4)
SPI1_MISO: 01_mcu (U4.31), 02_sensor (U5.1 U6.9 U7.5)
SPI1_MOSI: 01_mcu (U4.32), 02_sensor (U5.14 U6.11 U7.3)
SPI1_SCK: 01_mcu (U4.30), 02_sensor (U5.13 U6.1 U7.4)
SPI3_MISO: 01_mcu (U4.90), 03_peripheral (U23.2)
SPI3_MOSI: 01_mcu (U4.91), 03_peripheral (U23.5)
SPI3_SCK: 01_mcu (U4.89), 03_peripheral (U23.6)
SPL06_CS: 01_mcu (U4.36), 02_sensor (U7.2)
SWCLK: 01_mcu (U4.76), 03_peripheral (U21.2)
SWDIO: 01_mcu (U4.72), 03_peripheral (U21.1)
TIM4_CH1: 01_mcu (U4.92), 03_peripheral (R15.1)
TIM4_CH2: 01_mcu (U4.93), 03_peripheral (R14.1)
TIM4_CH3: 01_mcu (U4.95), 03_peripheral (R13.1)
TIM4_CH4: 01_mcu (U4.96), 03_peripheral (R8.1)
TIM9_CH1: 01_mcu (U4.4), 03_peripheral (R19.1)
TIM9_CH2: 01_mcu (U4.5), 03_peripheral (R20.1)
UART1_RX: 01_mcu (U4.69), 03_peripheral (R28.1)
UART1_TX: 01_mcu (U4.68), 03_peripheral (R33.1)
UART2_RX: 01_mcu (U4.87), 03_peripheral (R21.1)
UART2_TX: 01_mcu (U4.86), 03_peripheral (R29.1)
UART3_RX: 01_mcu (U4.56), 03_peripheral (R25.1)
UART3_TX: 01_mcu (U4.55), 03_peripheral (R32.1)
UART4_RX: 01_mcu (U4.79), 03_peripheral (R23.1)
UART4_TX: 01_mcu (U4.78), 03_peripheral (R30.1)
UART5_RX: 01_mcu (U4.83), 03_peripheral (Q1.3 R11.1)
UART6_RX: 01_mcu (U4.64), 03_peripheral (R24.1)
UART6_TX: 01_mcu (U4.63), 03_peripheral (R31.1)
USB_FS_D+: 01_mcu (U4.71), 03_peripheral (CN2.A6 CN2.B6 D1.2 D1.9)
USB_FS_D-: 01_mcu (U4.70), 03_peripheral (CN2.A7 CN2.B7 D1.1 D1.10)
W25Q16_CS: 01_mcu (U4.62), 03_peripheral (U23.1)